# Altium schematic sheet QuadOPTO.schdoc
size 405 x 445 mm
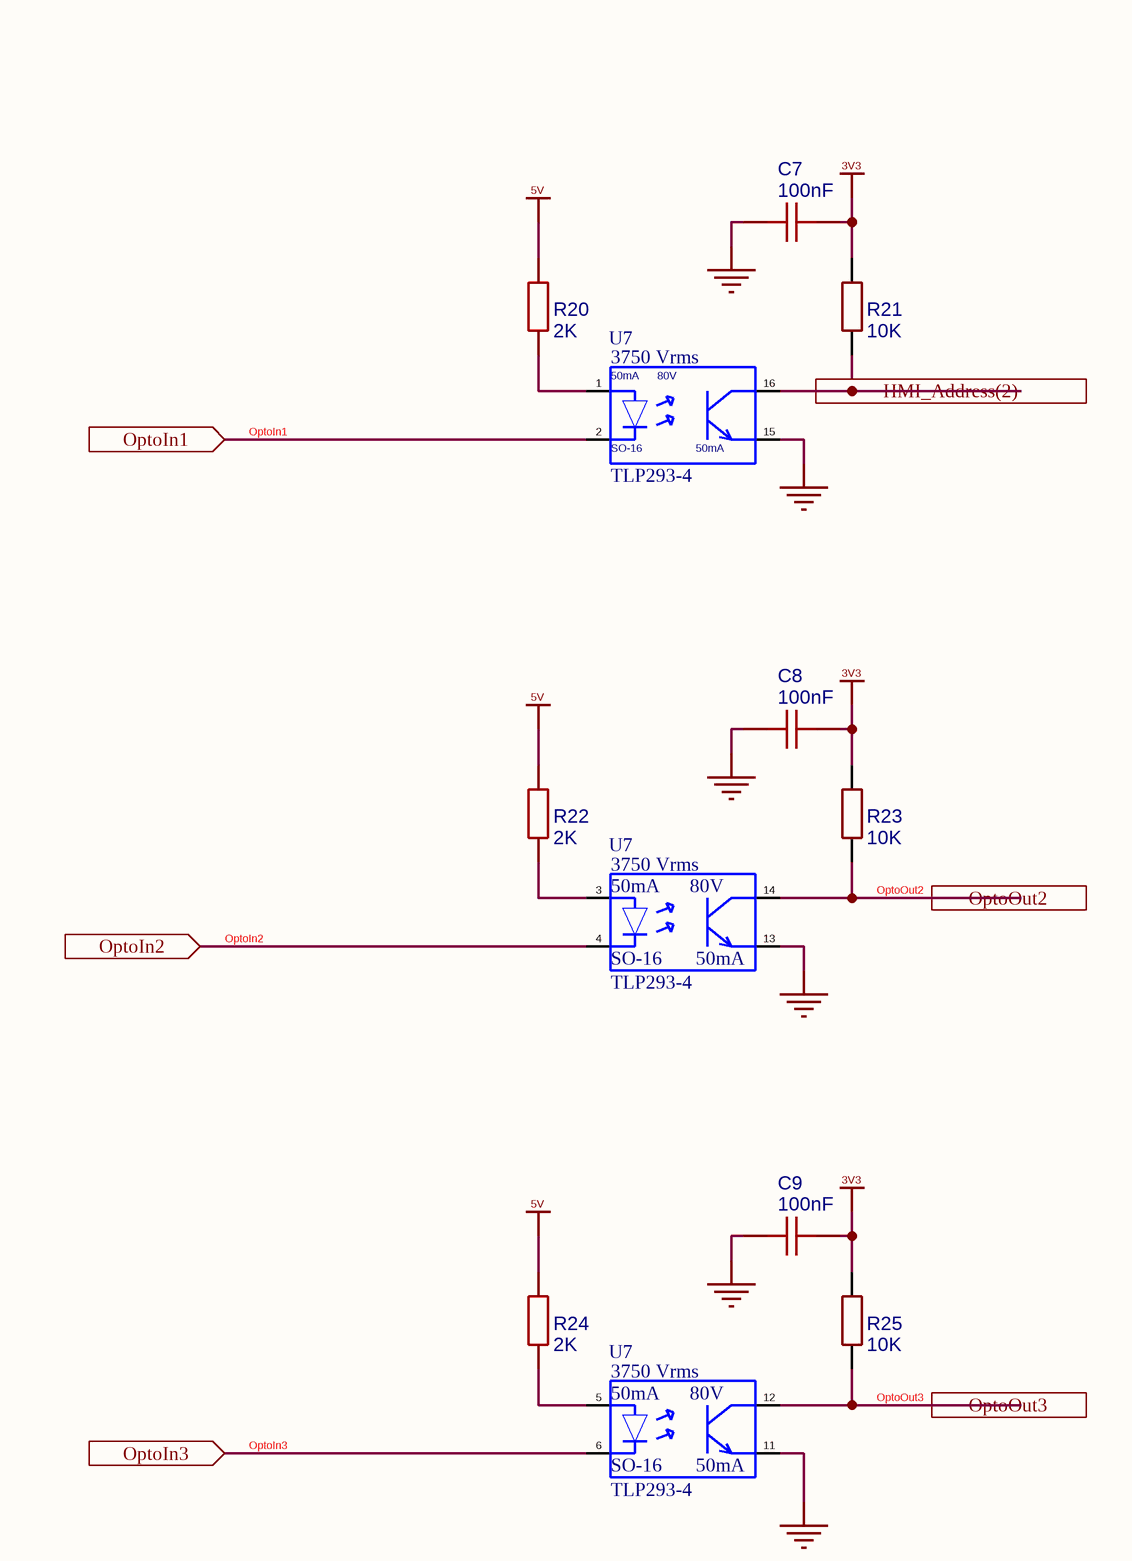
[diagram p0: QuadOPTO.schdoc, top left]
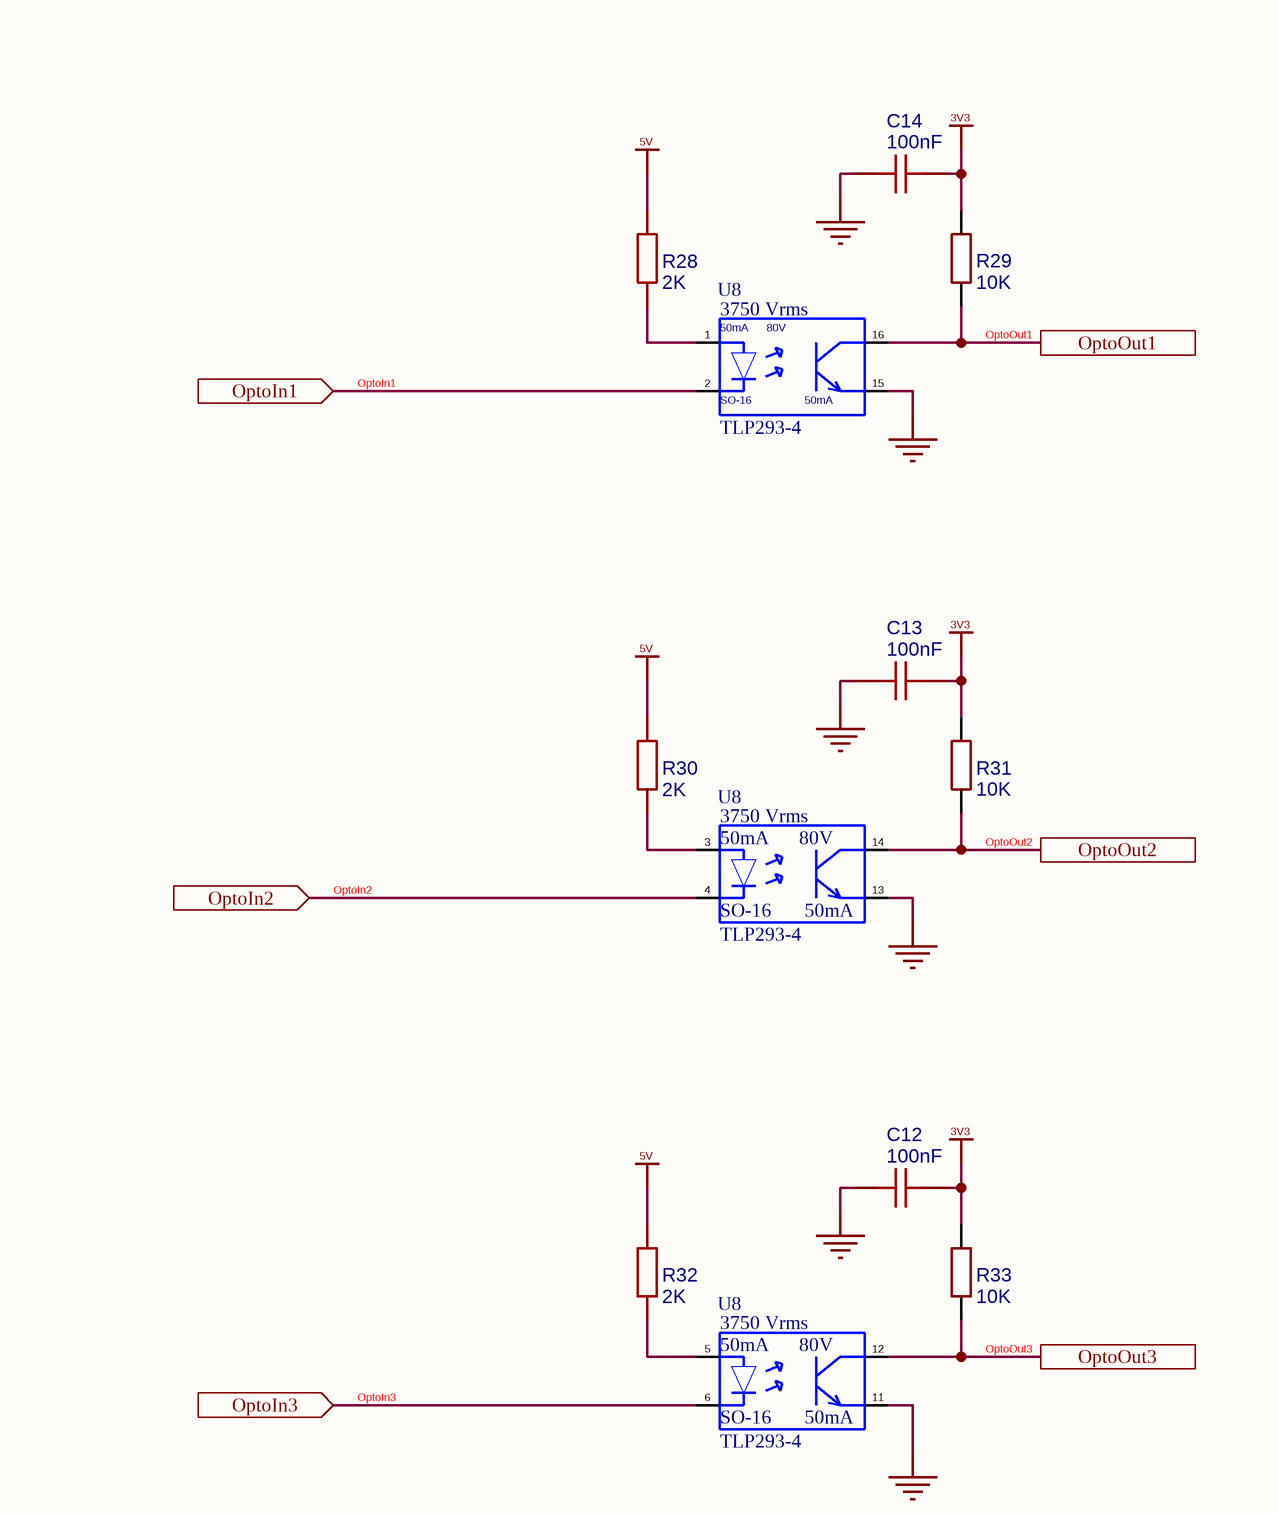
[diagram p1: QuadOPTO.schdoc, top middle]
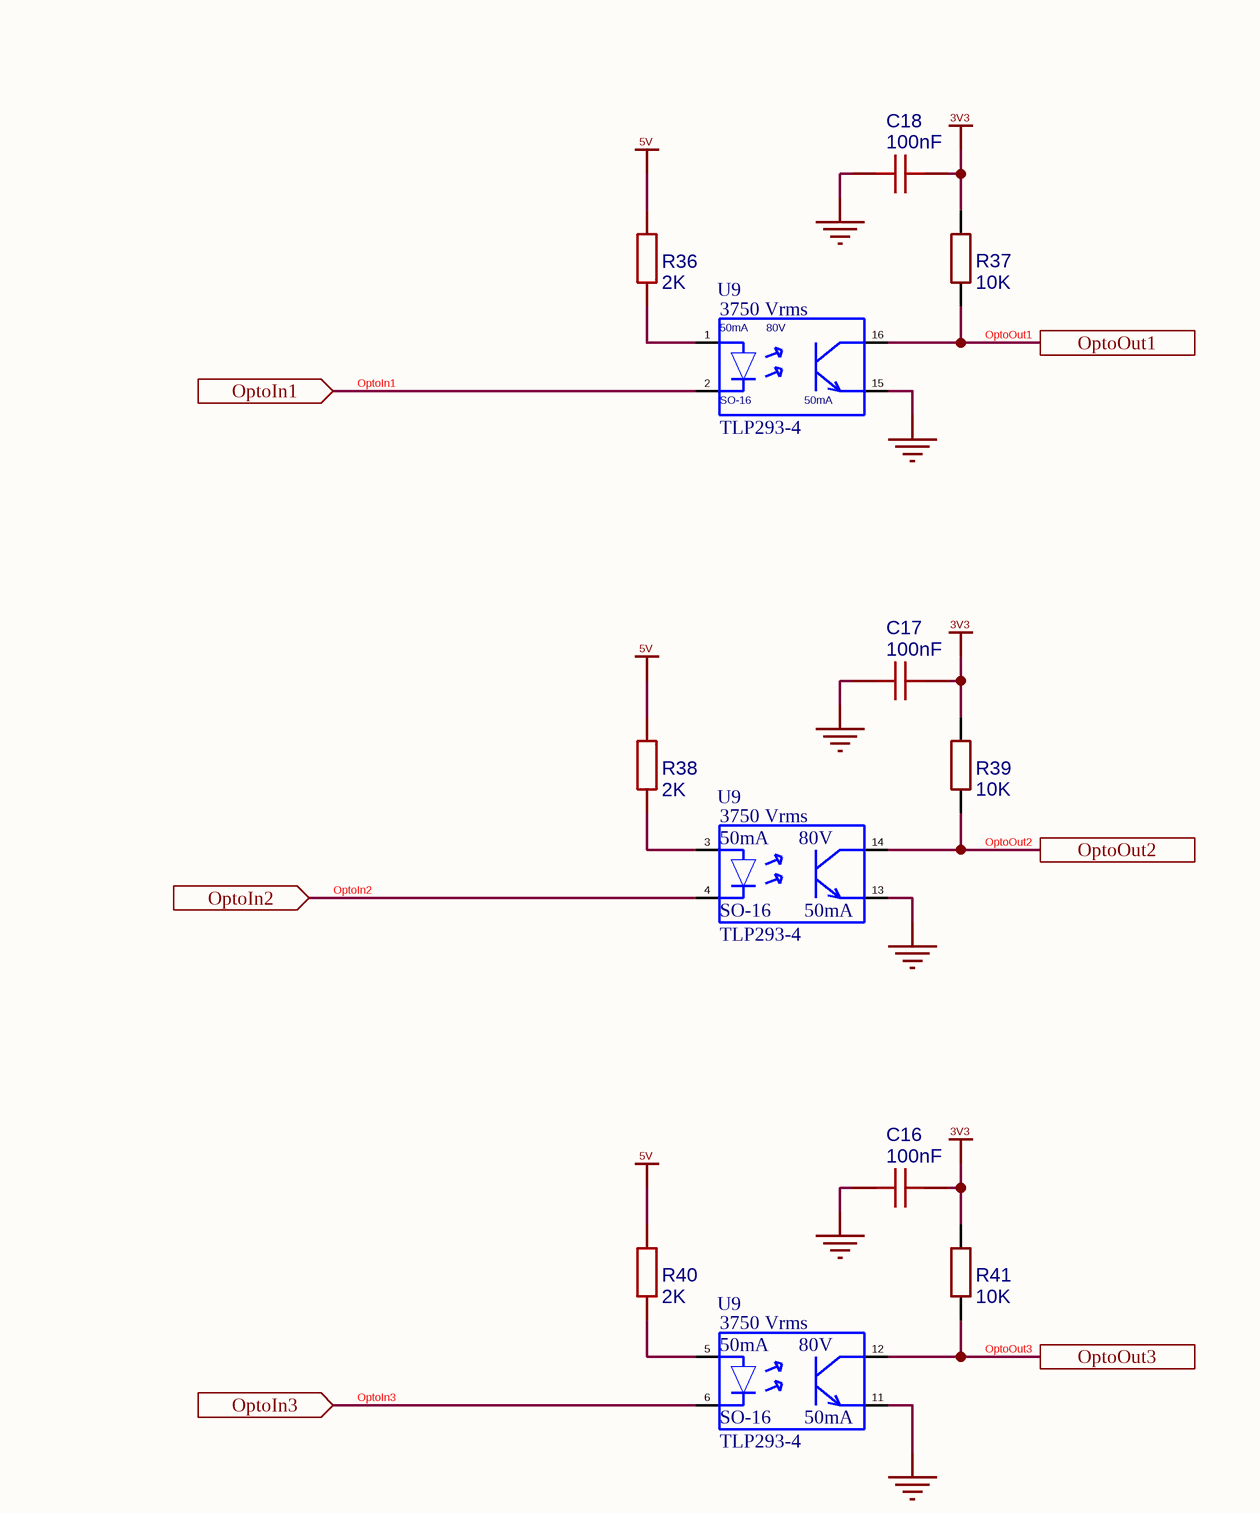
[diagram p2: QuadOPTO.schdoc, top right]
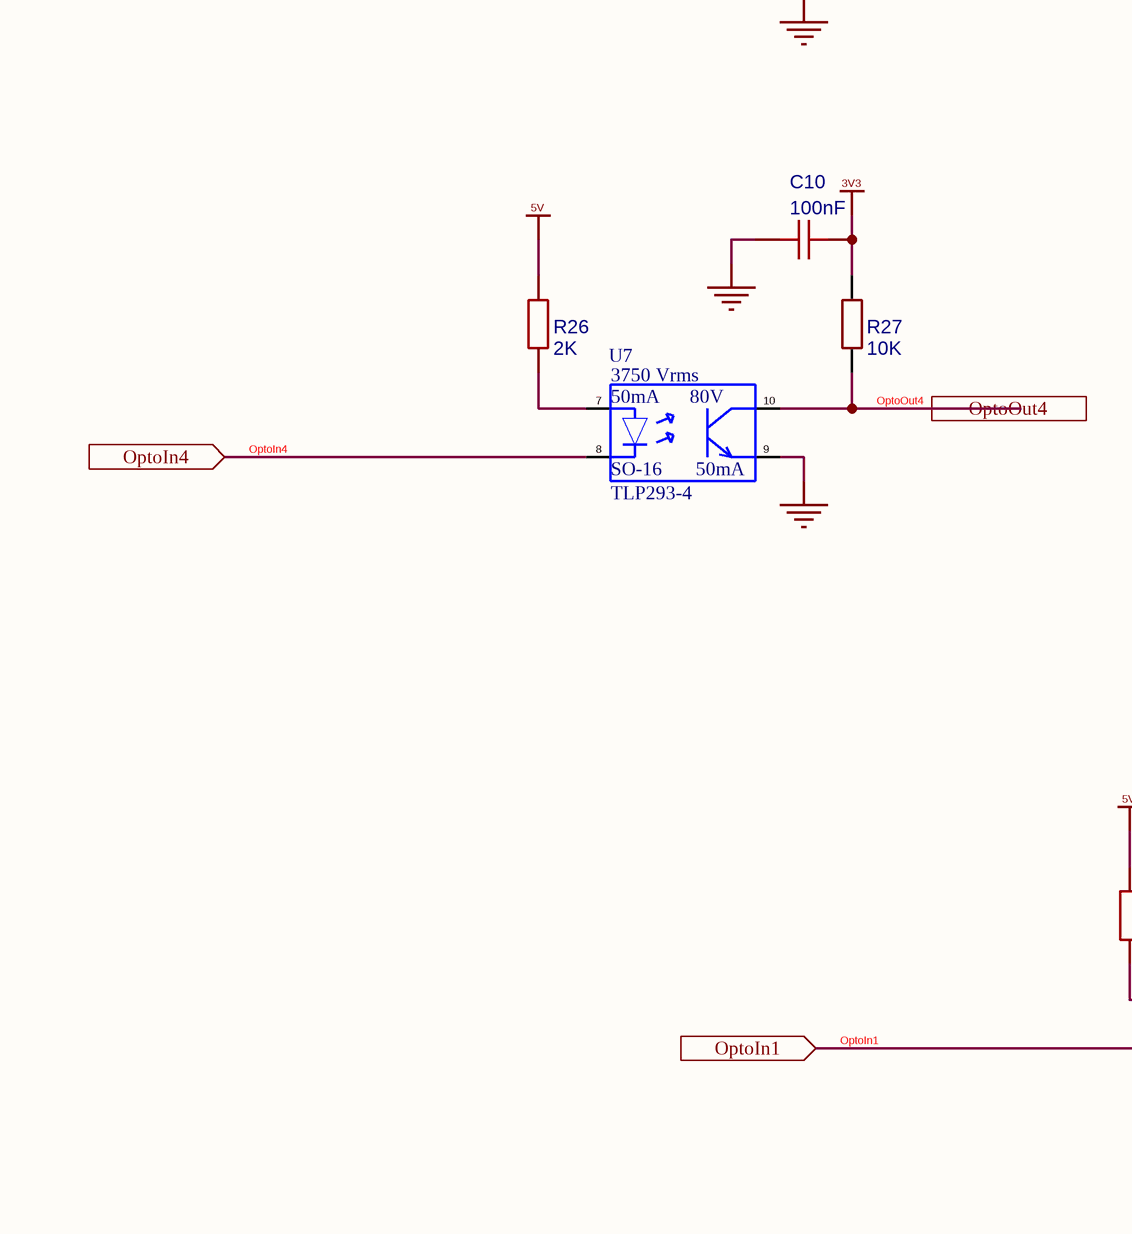
[diagram p3: QuadOPTO.schdoc, centre left]
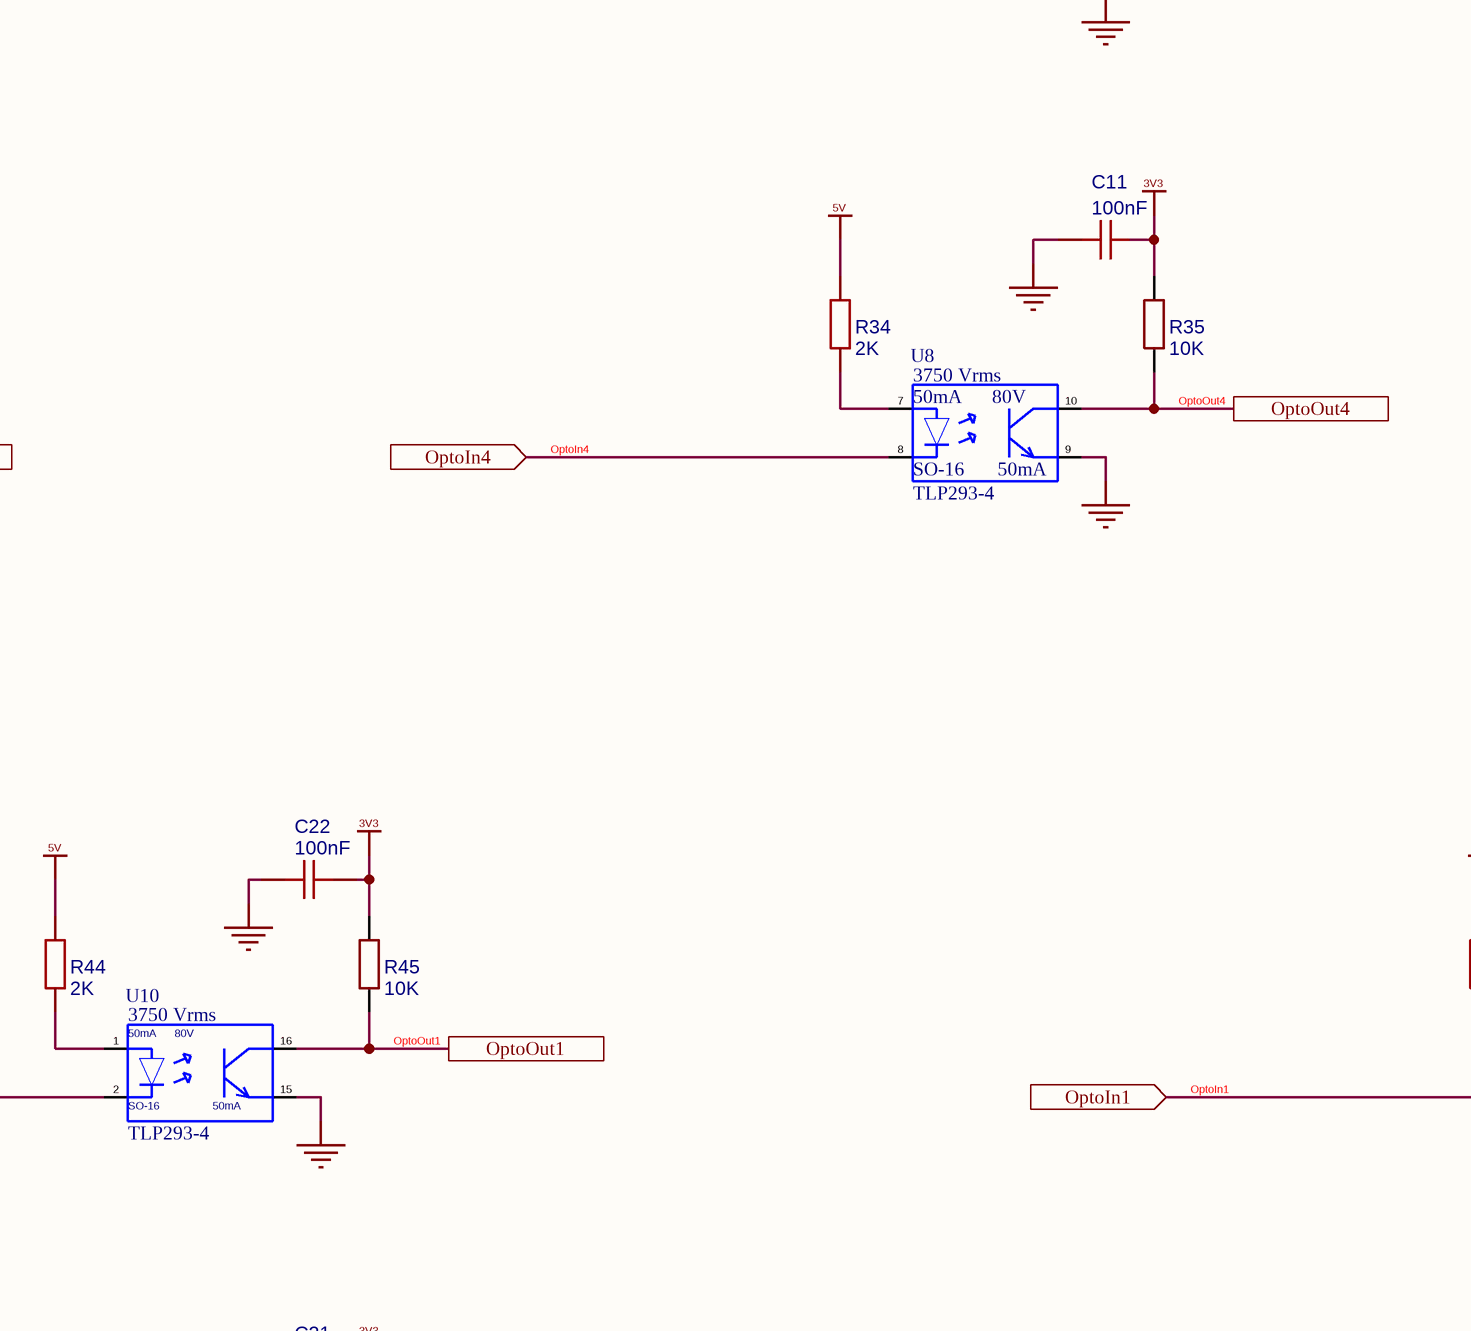
[diagram p4: QuadOPTO.schdoc, centre middle]
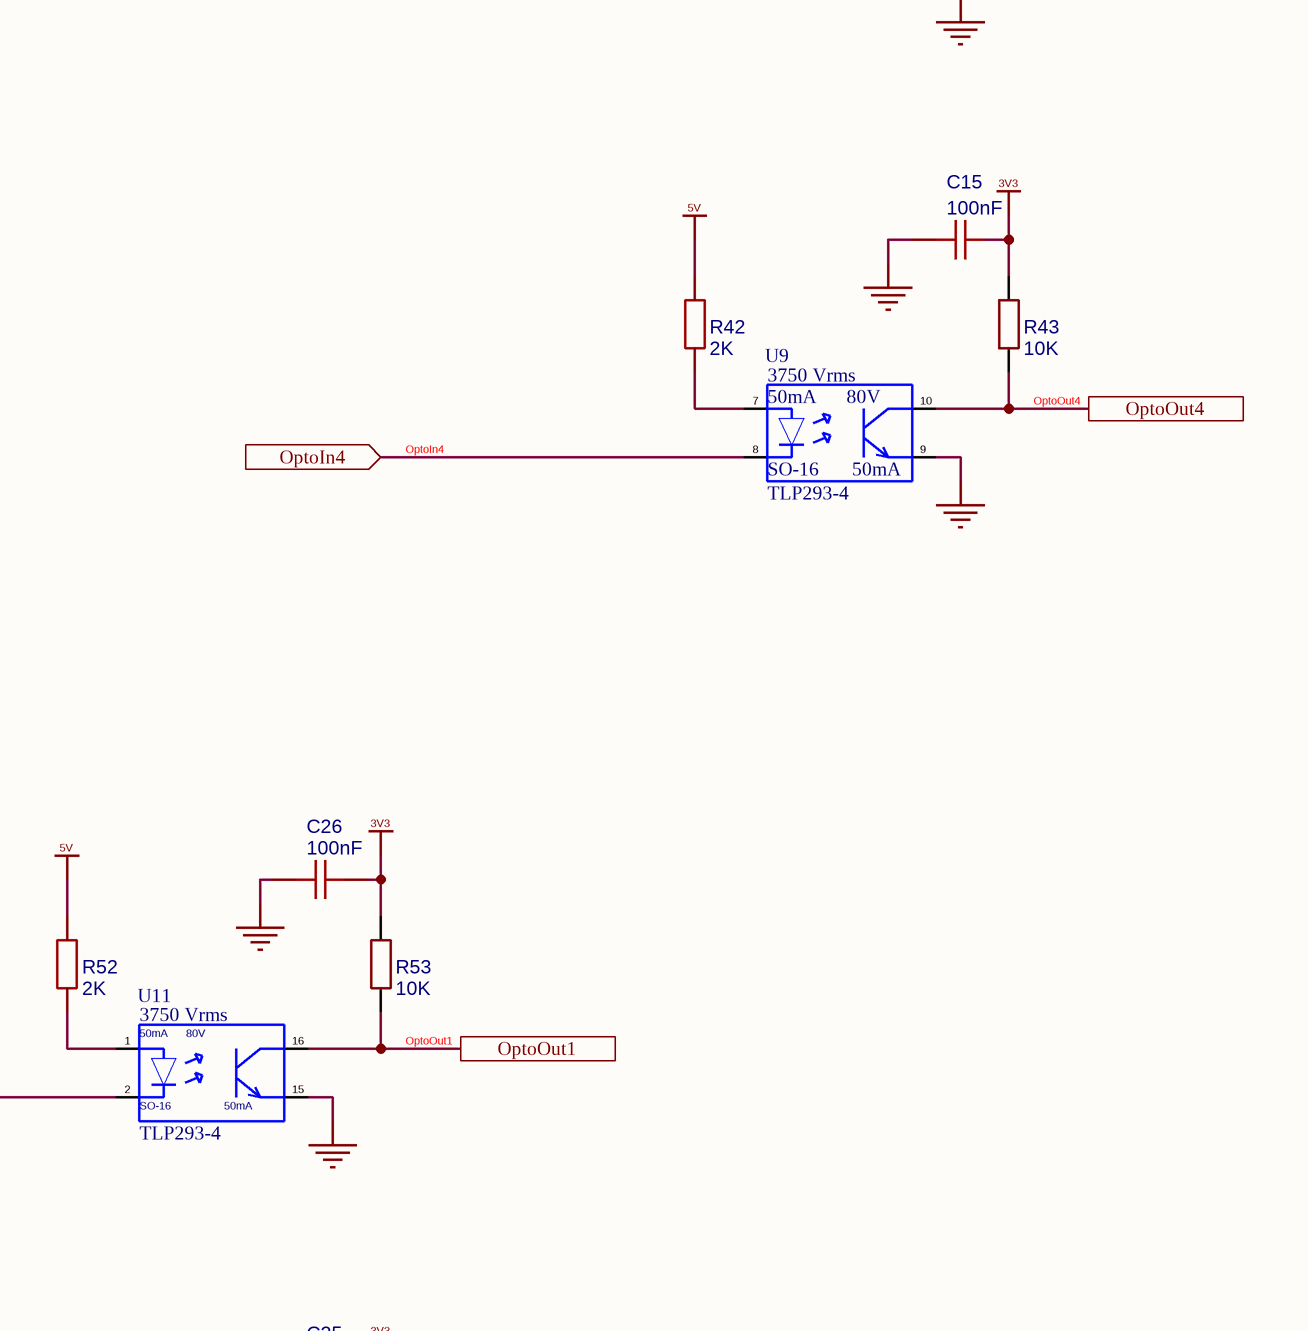
[diagram p5: QuadOPTO.schdoc, centre right]
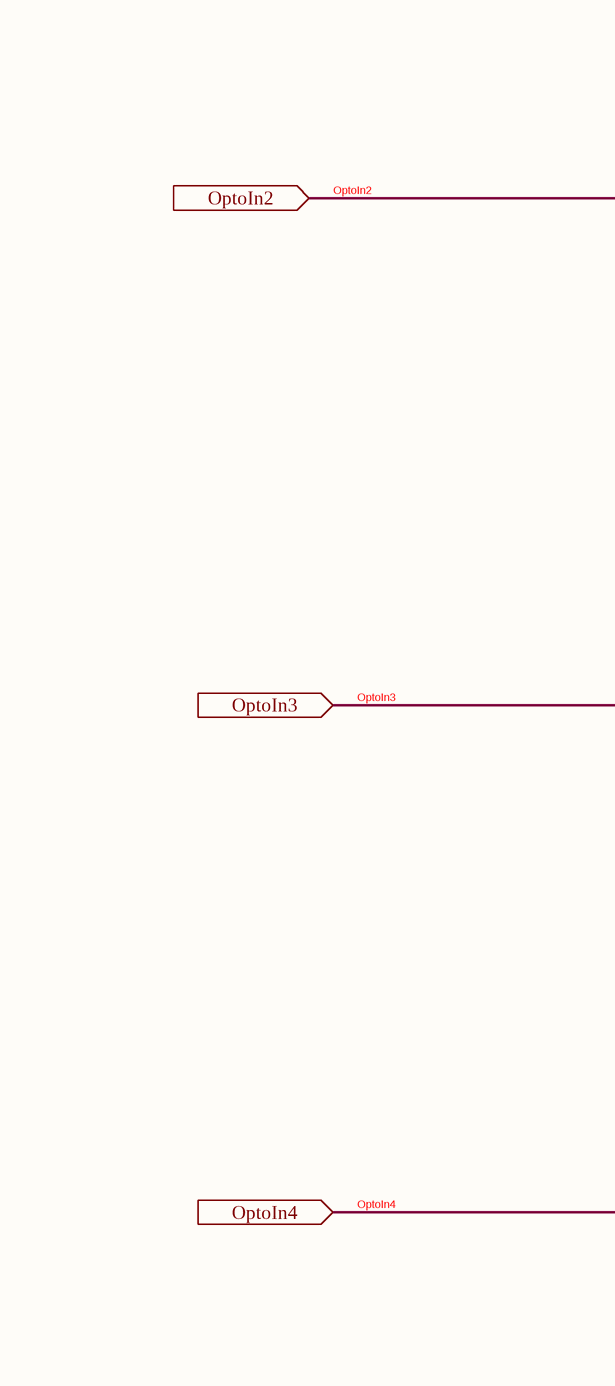
[diagram p6: QuadOPTO.schdoc, bottom left]
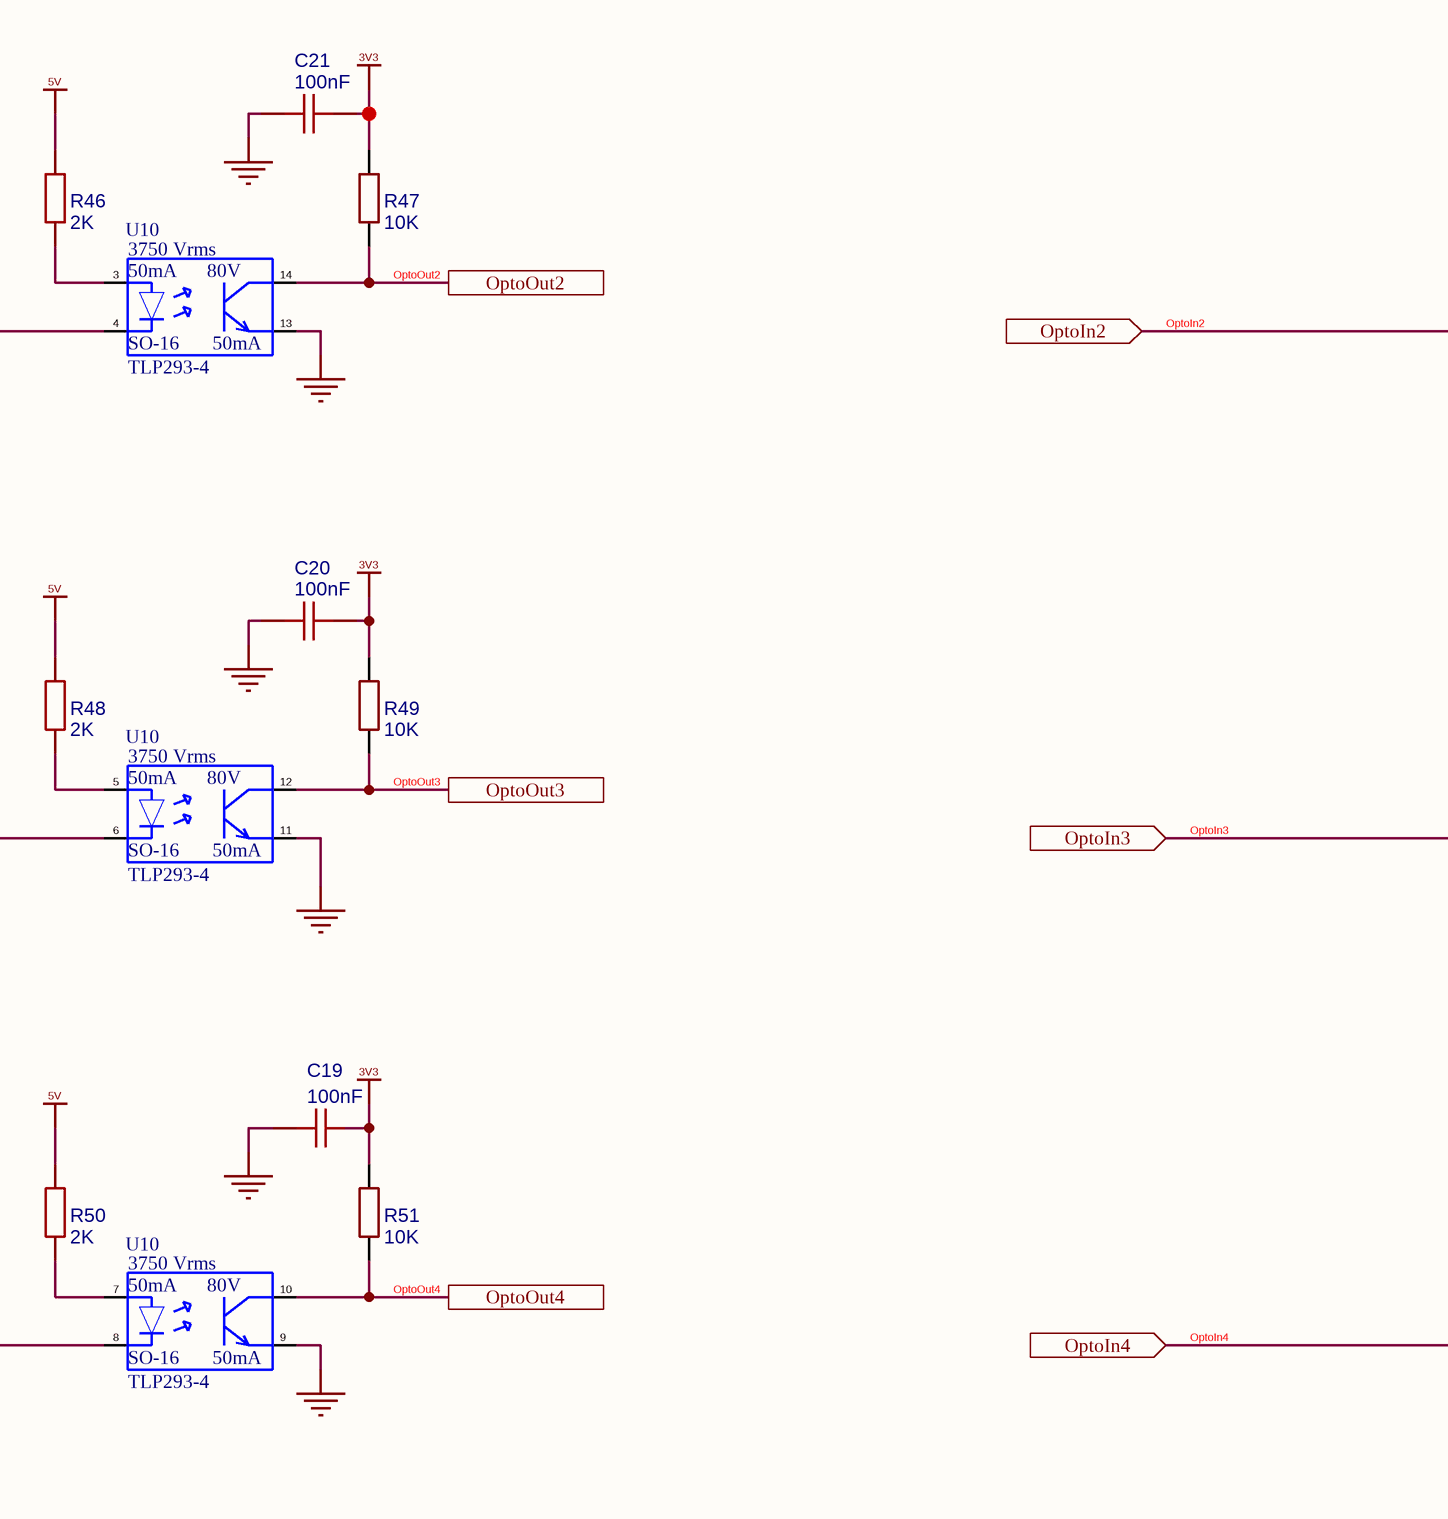
[diagram p7: QuadOPTO.schdoc, bottom middle]
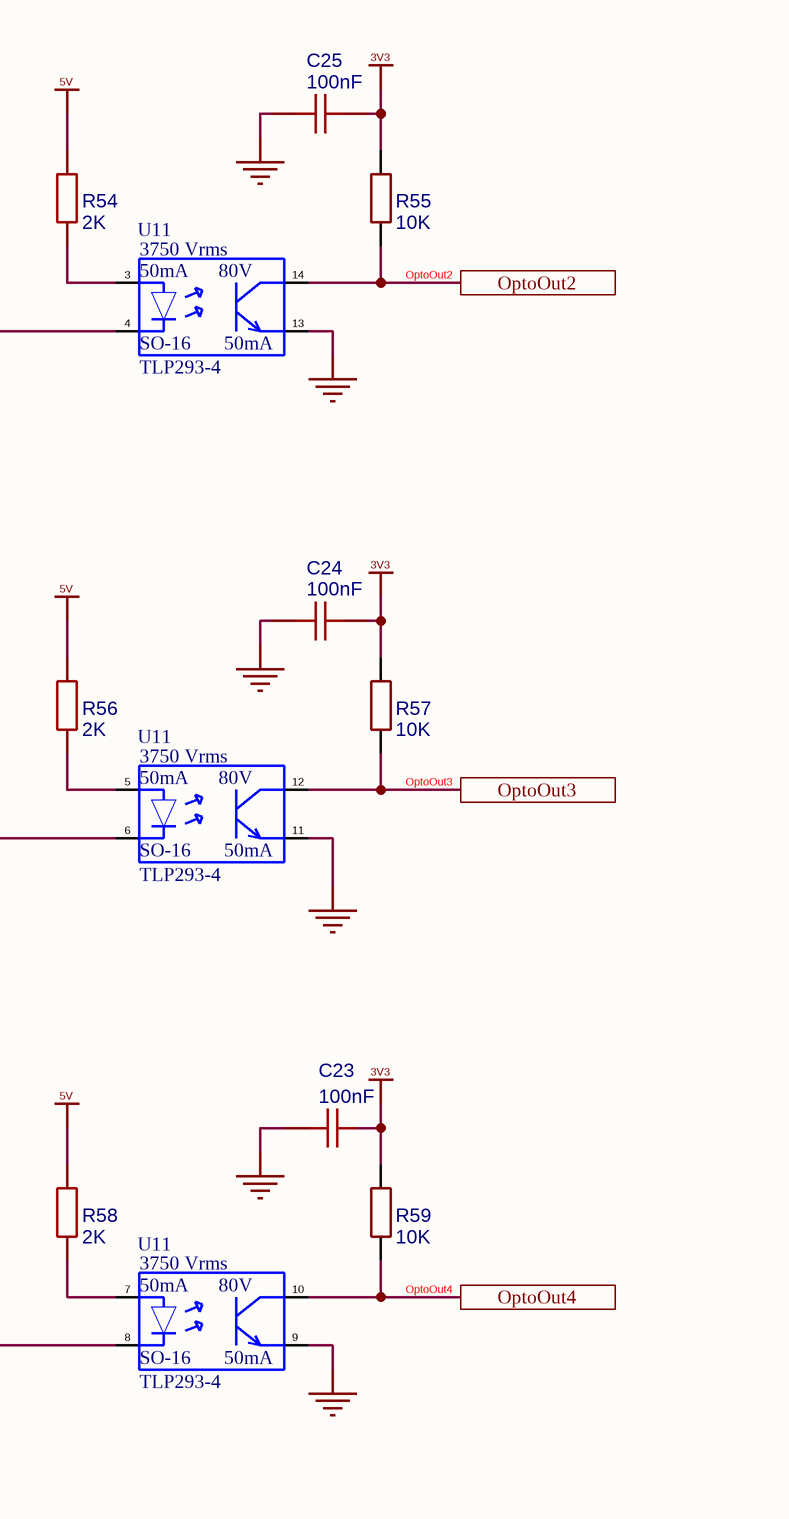
[diagram p8: QuadOPTO.schdoc, bottom right]

## Parts
(Parts that share a designator on the sheet are numbered #1, #2 ... from top to bottom, then left to right.)
C7  100nF  [C0402]
C8  100nF  [C0402]
C9  100nF  [C0402]
C10  100nF  [C0402]
C11  100nF  [C0402]
C12  100nF  [C0402]
C13  100nF  [C0402]
C14  100nF  [C0402]
C15  100nF  [C0402]
C16  100nF  [C0402]
C17  100nF  [C0402]
C18  100nF  [C0402]
C19  100nF  [C0402]
C20  100nF  [C0402]
C21  100nF  [C0402]
C22  100nF  [C0402]
C23  100nF  [C0402]
C24  100nF  [C0402]
C25  100nF  [C0402]
C26  100nF  [C0402]
R20  2K  [R0402]
R21  10K  [R0402]
R22  2K  [R0402]
R23  10K  [R0402]
R24  2K  [R0402]
R25  10K  [R0402]
R26  2K  [R0402]
R27  10K  [R0402]
R28  2K  [R0402]
R29  10K  [R0402]
R30  2K  [R0402]
R31  10K  [R0402]
R32  2K  [R0402]
R33  10K  [R0402]
R34  2K  [R0402]
R35  10K  [R0402]
R36  2K  [R0402]
R37  10K  [R0402]
R38  2K  [R0402]
R39  10K  [R0402]
R40  2K  [R0402]
R41  10K  [R0402]
R42  2K  [R0402]
R43  10K  [R0402]
R44  2K  [R0402]
R45  10K  [R0402]
R46  2K  [R0402]
R47  10K  [R0402]
R48  2K  [R0402]
R49  10K  [R0402]
R50  2K  [R0402]
R51  10K  [R0402]
R52  2K  [R0402]
R53  10K  [R0402]
R54  2K  [R0402]
R55  10K  [R0402]
R56  2K  [R0402]
R57  10K  [R0402]
R58  2K  [R0402]
R59  10K  [R0402]
U7#1  TLP293-4  [SO-16_L10.3-W4.4-P1.27-LS7.0-BL]
U7#2  TLP293-4  [SO-16_L10.3-W4.4-P1.27-LS7.0-BL]
U7#3  TLP293-4  [SO-16_L10.3-W4.4-P1.27-LS7.0-BL]
U7#4  TLP293-4  [SO-16_L10.3-W4.4-P1.27-LS7.0-BL]
U8#1  TLP293-4  [SO-16_L10.3-W4.4-P1.27-LS7.0-BL]
U8#2  TLP293-4  [SO-16_L10.3-W4.4-P1.27-LS7.0-BL]
U8#3  TLP293-4  [SO-16_L10.3-W4.4-P1.27-LS7.0-BL]
U8#4  TLP293-4  [SO-16_L10.3-W4.4-P1.27-LS7.0-BL]
U9#1  TLP293-4  [SO-16_L10.3-W4.4-P1.27-LS7.0-BL]
U9#2  TLP293-4  [SO-16_L10.3-W4.4-P1.27-LS7.0-BL]
U9#3  TLP293-4  [SO-16_L10.3-W4.4-P1.27-LS7.0-BL]
U9#4  TLP293-4  [SO-16_L10.3-W4.4-P1.27-LS7.0-BL]
U10#1  TLP293-4  [SO-16_L10.3-W4.4-P1.27-LS7.0-BL]
U10#2  TLP293-4  [SO-16_L10.3-W4.4-P1.27-LS7.0-BL]
U10#3  TLP293-4  [SO-16_L10.3-W4.4-P1.27-LS7.0-BL]
U10#4  TLP293-4  [SO-16_L10.3-W4.4-P1.27-LS7.0-BL]
U11#1  TLP293-4  [SO-16_L10.3-W4.4-P1.27-LS7.0-BL]
U11#2  TLP293-4  [SO-16_L10.3-W4.4-P1.27-LS7.0-BL]
U11#3  TLP293-4  [SO-16_L10.3-W4.4-P1.27-LS7.0-BL]
U11#4  TLP293-4  [SO-16_L10.3-W4.4-P1.27-LS7.0-BL]

## Ports
HMI_Address(2) (in), OptoIn1 (in), OptoIn2 (in), OptoIn3 (in), OptoIn4 (in), OptoOut1 (in), OptoOut2 (in), OptoOut3 (in), OptoOut4 (in)

## Nets
3V3: C7.1 C8.1 C9.1 C10.1 C11.1 C12.1 C13.1 C14.1 C15.1 C16.1 C17.1 C18.1 C19.1 C20.1 C21.1 C22.1 C23.1 C24.1 C25.1 C26.1 R21.2 R23.2 R25.2 R27.2 R29.2 R31.2 R33.2 R35.2 R37.2 R39.2 R41.2 R43.2 R45.2 R47.2 R49.2 R51.2 R53.2 R55.2 R57.2 R59.2
5V: R20.2 R22.2 R24.2 R26.2 R28.2 R30.2 R32.2 R34.2 R36.2 R38.2 R40.2 R42.2 R44.2 R46.2 R48.2 R50.2 R52.2 R54.2 R56.2 R58.2
GND: C7.2 C8.2 C9.2 C10.2 C11.2 C12.2 C13.2 C14.2 C15.2 C16.2 C17.2 C18.2 C19.2 C20.2 C21.2 C22.2 C23.2 C24.2 C25.2 C26.2 U7#1.15(E) U7#2.13(E) U7#3.11(E) U7#4.9(E) U8#1.15(E) U8#2.13(E) U8#3.11(E) U8#4.9(E) U9#1.15(E) U9#2.13(E) U9#3.11(E) U9#4.9(E) U10#1.15(E) U10#2.13(E) U10#3.11(E) U10#4.9(E) U11#1.15(E) U11#2.13(E) U11#3.11(E) U11#4.9(E)
HMI_Address(2): R21.1 U7#1.16(C) ; port HMI_Address(2)
OptoIn1: U7#1.2(K) U8#1.2(K) U9#1.2(K) U10#1.2(K) U11#1.2(K) ; port OptoIn1
OptoIn2: U7#2.4(K) U8#2.4(K) U9#2.4(K) U10#2.4(K) U11#2.4(K) ; port OptoIn2
OptoIn3: U7#3.6(K) U8#3.6(K) U9#3.6(K) U10#3.6(K) U11#3.6(K) ; port OptoIn3
OptoIn4: U7#4.8(K) U8#4.8(K) U9#4.8(K) U10#4.8(K) U11#4.8(K) ; port OptoIn4
OptoOut1: R29.1 R37.1 R45.1 R53.1 U8#1.16(C) U9#1.16(C) U10#1.16(C) U11#1.16(C) ; port OptoOut1
OptoOut2: R23.1 R31.1 R39.1 R47.1 R55.1 U7#2.14(C) U8#2.14(C) U9#2.14(C) U10#2.14(C) U11#2.14(C) ; port OptoOut2
OptoOut3: R25.1 R33.1 R41.1 R49.1 R57.1 U7#3.12(C) U8#3.12(C) U9#3.12(C) U10#3.12(C) U11#3.12(C) ; port OptoOut3
OptoOut4: R27.1 R35.1 R43.1 R51.1 R59.1 U7#4.10(C) U8#4.10(C) U9#4.10(C) U10#4.10(C) U11#4.10(C) ; port OptoOut4
NetR20_1: R20.1 U7#1.1(A)
NetR22_1: R22.1 U7#2.3(A)
NetR24_1: R24.1 U7#3.5(A)
NetR26_1: R26.1 U7#4.7(A)
NetR28_1: R28.1 U8#1.1(A)
NetR30_1: R30.1 U8#2.3(A)
NetR32_1: R32.1 U8#3.5(A)
NetR34_1: R34.1 U8#4.7(A)
NetR36_1: R36.1 U9#1.1(A)
NetR38_1: R38.1 U9#2.3(A)
NetR40_1: R40.1 U9#3.5(A)
NetR42_1: R42.1 U9#4.7(A)
NetR44_1: R44.1 U10#1.1(A)
NetR46_1: R46.1 U10#2.3(A)
NetR48_1: R48.1 U10#3.5(A)
NetR50_1: R50.1 U10#4.7(A)
NetR52_1: R52.1 U11#1.1(A)
NetR54_1: R54.1 U11#2.3(A)
NetR56_1: R56.1 U11#3.5(A)
NetR58_1: R58.1 U11#4.7(A)

## Library data of the parts
C7-C26 = 100nF: BOM_Manufacturer: TDK; BOM_Manufacturer Part: C1005X7R1C104KT000F; nameAlias: Capacitance; Contributor: LCSC; BOM_Supplier: LCSC; BOM_Supplier Part: C338032; spicePre: C; spiceSymbolName: C1005X7R1C104KT000F
R20 R22 R24 R26 R28 R30 R32 R34 R36 R38 R40 R42 R44 R46 R48 R50 R52 R54 R56 R58 = 2K: BOM_Manufacturer: KOA; BOM_Manufacturer Part: RN731ETTP2001F25; nameAlias: Resistance (Ohms); Contributor: LCSC; BOM_Supplier: LCSC; BOM_Supplier Part: C134242; BOM_JLCPCB Part Class: Extended Part; spicePre: R; spiceSymbolName: RN731ETTP2001F25
R21 R23 R25 R27 R29 R31 R33 R35 R37 R39 R41 R43 R45 R47 R49 R51 R53 R55 R57 R59 = 10K: BOM_Manufacturer: UniOhm; BOM_Manufacturer Part: 0402WGF1002TCE; nameAlias: Resistance (Ohms); BOM_Supplier: LCSC; BOM_Supplier Part: C25744; BOM_JLCPCB Part Class: Basic Part; spicePre: R; spiceSymbolName: 0402WGF1002TCE
U7#1-U7#4 U8#1-U8#4 U9#1-U9#4 U10#1-U10#4 U11#1-U11#4 = TLP293-4: PART NUMBER: TLP293-4(V4,E; Power: 50mA      80V; OVPN: OVIC00228; MFG: Toshiba Semiconductor and Storage; ISO: 3750 Vrms; Current Power: 50mA; PCB Footprint: SO-16_TLP293-4; FootPrint: SO-16